# EAGLE design BCNK Blinker attiny13 (EAGLE 5.00)
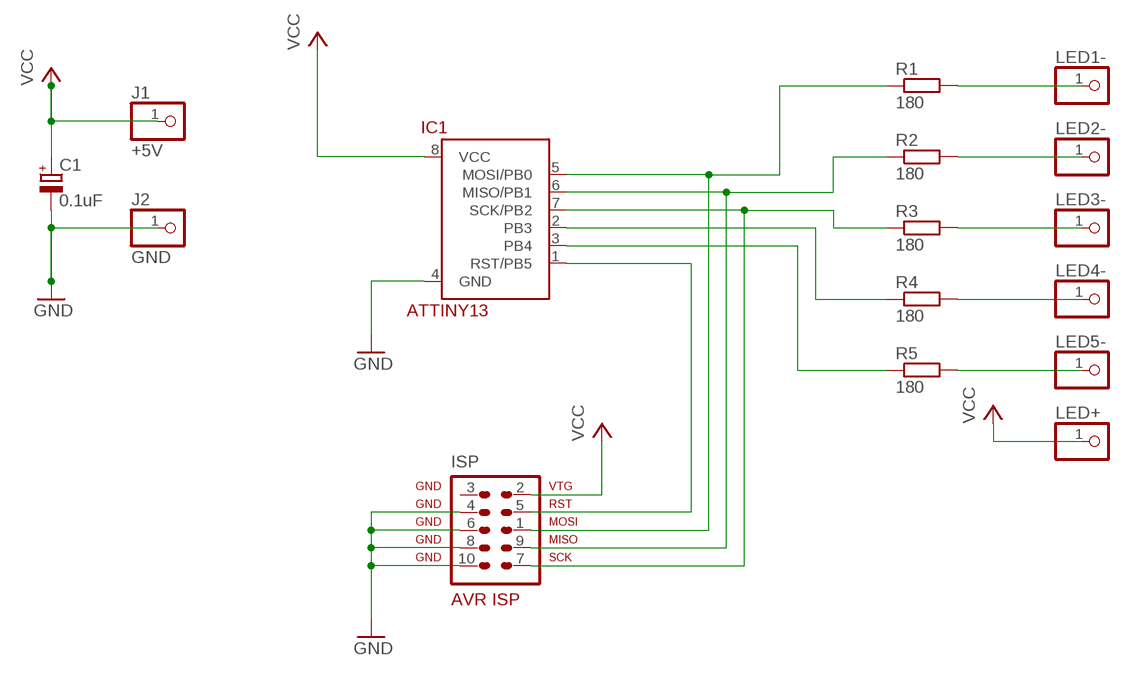
[diagram p0: schematic, sheet 1]

## Parts
C1  0.1uF  CPOL-EUE2.5-5  [E2,5-5]
IC1  ATTINY13  ATTINY13-20PU  [DIL08]
ISP  AVR-ISP-10ML  [ML10]
J1  +5V  PINHD-1X1  [1X01]
J2  GND  PINHD-1X1  [1X01]
LED1-  PINHD-1X1  [1X01]
LED2-  PINHD-1X1  [1X01]
LED3-  PINHD-1X1  [1X01]
LED4-  PINHD-1X1  [1X01]
LED5-  PINHD-1X1  [1X01]
LED+  PINHD-1X1  [1X01]
R1  180  R-EU_0207/2V  [0207/2V]
R2  180  R-EU_0207/2V  [0207/2V]
R3  180  R-EU_0207/2V  [0207/2V]
R4  180  R-EU_0207/2V  [0207/2V]
R5  180  R-EU_0207/2V  [0207/2V]

## Nets
GND: C1.- IC1.4(GND) ISP.4 ISP.6 ISP.8 ISP.10 J2.1
N$1: IC1.1(RST/PB5) ISP.5
N$2: IC1.5(MOSI/PB0) ISP.1 R1.1
N$3: IC1.6(MISO/PB1) ISP.9 R2.1
N$4: IC1.7(SCK/PB2) ISP.7 R3.1
N$5: IC1.2(PB3) R4.1
N$6: IC1.3(PB4) R5.1
N$7: LED1-.1 R1.2
N$8: LED2-.1 R2.2
N$9: LED3-.1 R3.2
N$10: LED4-.1 R4.2
N$11: LED5-.1 R5.2
VCC: C1.+ IC1.8(VCC) ISP.2 J1.1 LED+.1
Unconnected: ISP.3

## Library data of the parts
C1 = rcl:CPOL-EU: POLARIZED CAPACITOR, European symbol
IC1 = attiny13:ATTINY13-20*
ISP = atmel-1:AVR-ISP-10: AVR ISP-10 Serial Programming Header
J1 J2 LED1- LED2- LED3- LED4- LED5- LED+ = pinhead:PINHD-1X1: PIN HEADER
R1-R5 = rcl:R-EU_: RESISTOR, European symbol

## Board
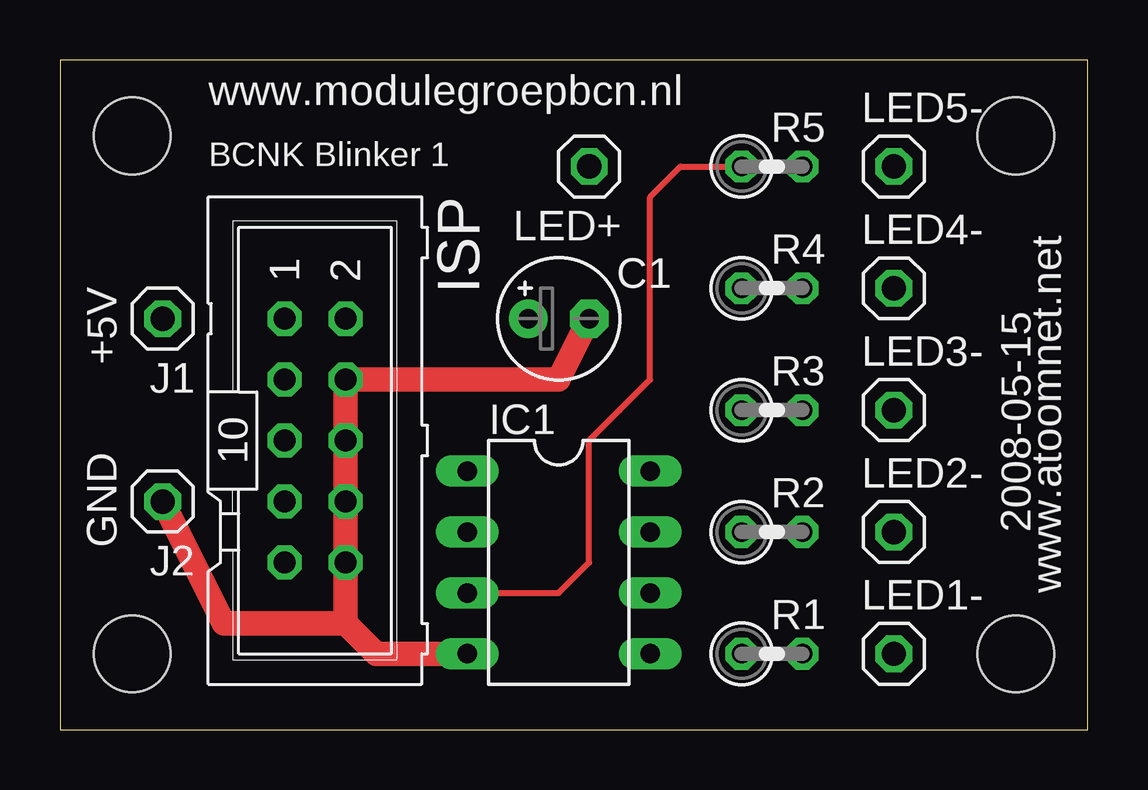
[diagram p1: board, top side]
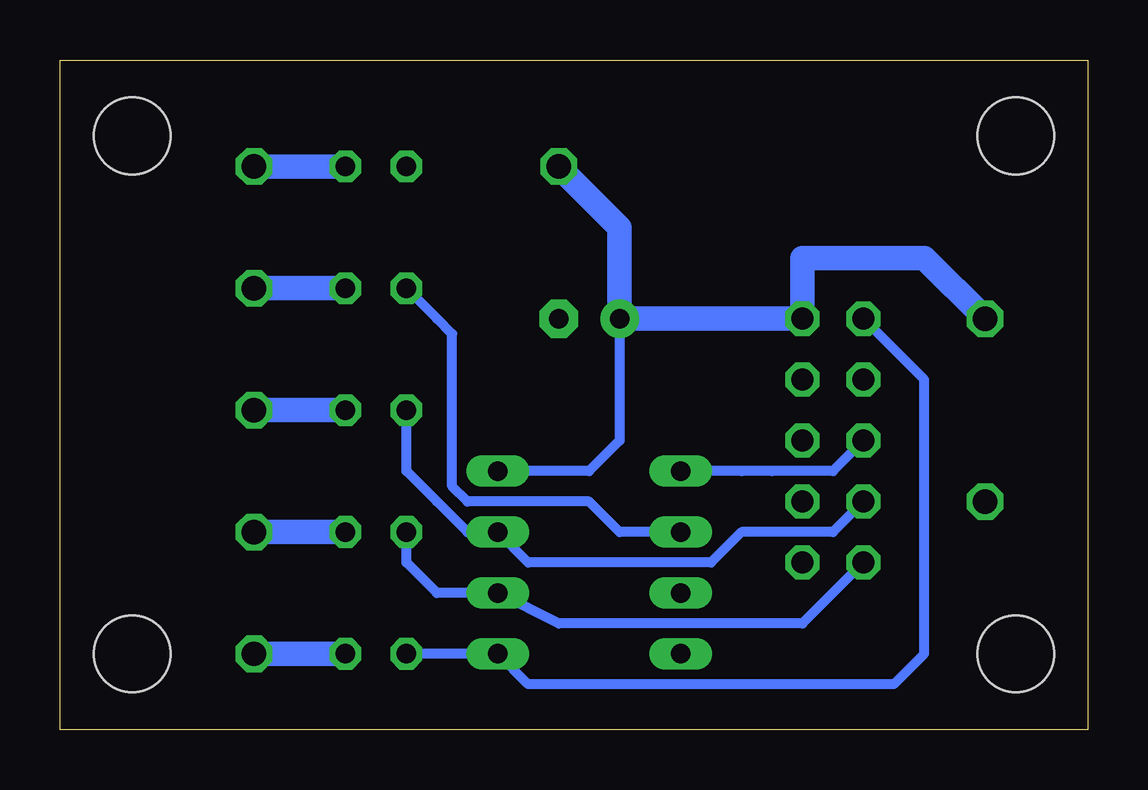
[diagram p2: board, bottom side, seen from below]

Size 42.85 x 27.93 mm. Coordinates in mm from the lower left corner, seen from the top.
Outline: 0,0 42.85,0 42.85,27.93 0,27.93 0,0
Copper layers (1*16): Top 0.035mm / dielectric 1.5mm / Bottom 0.035mm
Design rules "default": minimum track width 10mil, minimum drill 24mil, track to track 8mil, track to pad 8mil, pad to pad 8mil, via to via 8mil, smd to smd 8mil, copper to edge 40mil, drill to drill 8mil, minimum pad ring 10mil, minimum via ring 8mil, stop-mask expansion 4mil, vias tented up to drill 0mil, thermal gap 10mil
Holes 3.2 mm at 3.01,3.17 3.01,24.76 39.84,3.17 39.84,24.76

### Footprints (pad centres in the part's own frame; a part is rotated, then mirrored left to right if it is on the bottom)
E2,5-5 = drill 0.813 pad 1.6 round: + -1.27,0 | drill 0.813 pad 1.6 octagon: - 1.27,0
DIL08 = drill 0.813 long: 1 -3.81,-3.81; 2 -1.27,-3.81; 3 1.27,-3.81; 4 3.81,-3.81; 5 3.81,3.81; 6 1.27,3.81; 7 -1.27,3.81; 8 -3.81,3.81
ML10 = drill 0.914 octagon: 1 -5.08,-1.27; 2 -5.08,1.27; 3 -2.54,-1.27; 4 -2.54,1.27; 5 0,-1.27; 6 0,1.27; 7 2.54,-1.27; 8 2.54,1.27; 9 5.08,-1.27; 10 5.08,1.27
1X01 = drill 1.016 octagon: 1 0,0
0207/2V = drill 0.813 octagon: 1 -1.27,0; 2 1.27,0

### Placement (x,y rotation side)
C1  20.79,17.14 0 top
IC1  20.79,6.98 270 top
ISP  10.63,12.06 270 top
J1  4.28,17.14 180 top
J2  4.28,9.52 180 top
LED1-  34.76,3.17 0 top
LED2-  34.76,8.25 0 top
LED3-  34.76,13.33 0 top
LED4-  34.76,18.41 0 top
LED5-  34.76,23.49 0 top
LED+  22.06,23.49 180 top
R1  29.68,3.17 0 top
R2  29.68,8.25 0 top
R3  29.68,13.33 0 top
R4  29.68,18.41 0 top
R5  29.68,23.49 0 top

### Tracks (layer width: path | path; a pad name or v marks a point on that pad's centre or on a via)
GND
  Top 1.016: C1.- 20.79,14.6 ISP.4 ISP.6 ISP.8 ISP.10 | J2.1 6.82,4.44 11.9,4.44 | 11.9,4.44 ISP.10 | 11.9,4.44 13.17,3.17 IC1.4 | 11.9,4.44 ISP.10
N$1
  Bottom 0.406: IC1.1 14.44,10.79 13.17,10.79 10.63,10.79 ISP.5
N$2
  Bottom 0.406: R1.1 IC1.5 23.33,1.9 8.09,1.9 6.82,3.17 6.82,14.6 ISP.1
N$3
  Bottom 0.406: R2.1 28.41,6.98 27.14,5.71 IC1.6 22.06,4.44 11.9,4.44 ISP.9
N$4
  Bottom 0.406: R3.1 28.41,10.79 27.14,9.52 25.87,8.25 IC1.7 23.33,6.98 15.71,6.98 14.44,8.25 10.63,8.25 ISP.7
N$5
  Bottom 0.406: R4.1 27.14,17.14 26.5,16.5 26.5,10.16 25.87,9.52 20.79,9.52 19.52,8.25 IC1.2
N$6
  Top 0.254: IC1.3 20.79,5.71 22.06,6.98 22.06,12.06 23.33,13.33 24.6,14.6 24.6,22.22 25.87,23.49 R5.1
N$7
  Bottom 1.016: R1.2 LED1-.1
N$8
  Bottom 1.016: R2.2 LED2-.1
N$9
  Bottom 1.016: R3.2 LED3-.1
N$10
  Bottom 1.016: R4.2 LED4-.1
N$11
  Bottom 1.016: R5.2 LED5-.1
VCC
  Bottom 0.406: C1.+ 19.52,12.06 20.79,10.79 IC1.8
  Bottom 1.016: J1.1 6.82,19.68 11.9,19.68 ISP.2 C1.+ 19.52,20.95 LED+.1

### Text on the board
tNames: www.modulegroepbcn.nl | BCNK Blinker 1 | +5V | 2008-05-15 | GND | www.atoomnet.net